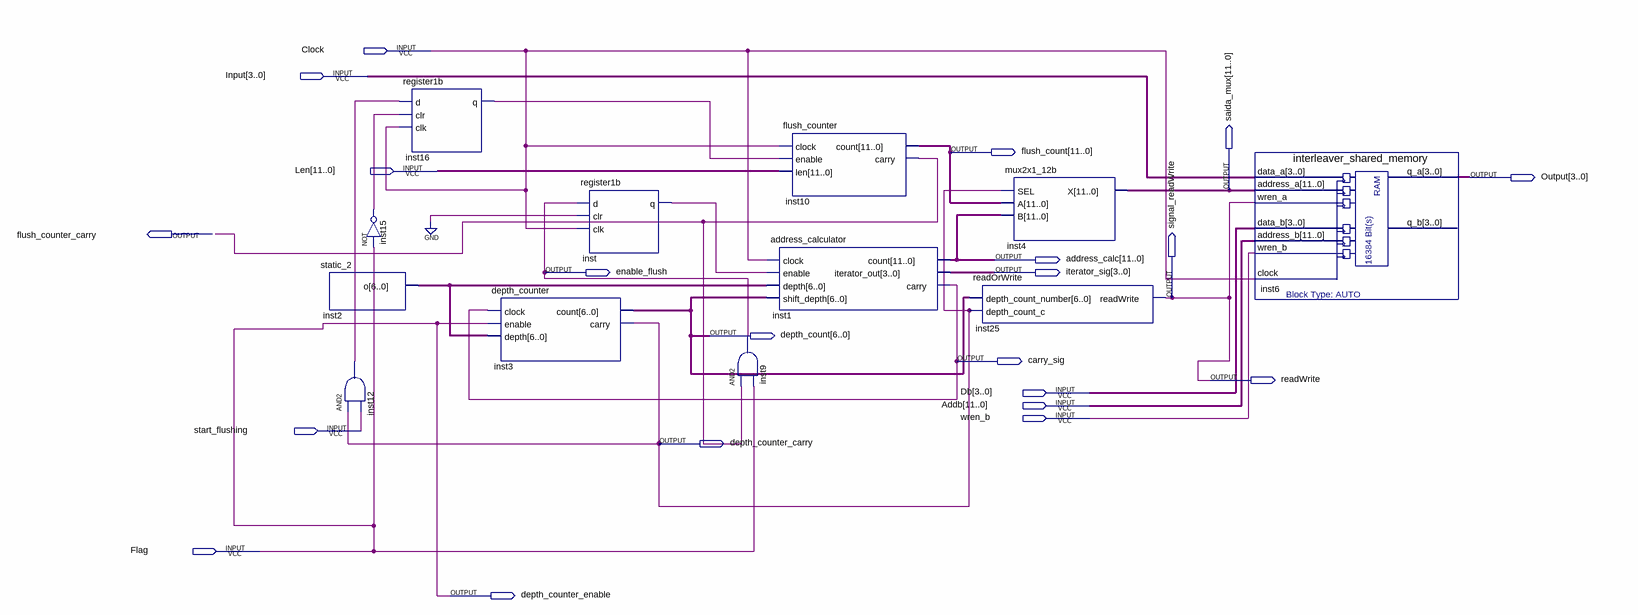
[diagram p0: schematic sheet]
// Quartus schematic interleaver_header.bdf as structural Verilog: 12 symbols, 21 pins
module interleaver_header (
  input  Clock,
  input  [3:0] Input,
  input  [11:0] Len,
  input  [3:0] Db,
  input  [11:0] Addb,
  input  wren_b,
  input  start_flushing,
  input  Flag,
  output [11:0] flush_count,
  output [3:0] Output,
  output [11:0] saida_mux,
  output flush_counter_carry,
  output [11:0] address_calc,
  output enable_flush,
  output [3:0] iterator_sig,
  output signal_readWrite,
  output [6:0] depth_count,
  output carry_sig,
  output readWrite,
  output depth_counter_carry,
  output depth_counter_enable
);

  wire inst12_out, inst15_out, inst16_q, inst_q;
  wire [6:0] inst2_o;

  static_2 inst2 (.o(inst2_o));
  and inst12 (inst12_out, depth_counter_carry, start_flushing);
  register1b inst16 (.d(inst12_out), .clr(inst15_out), .clk(Clock), .q(inst16_q));
  not inst15 (inst15_out, Flag);
  depth_counter inst3 (
    .clock(carry_sig), .enable(Flag), .depth(inst2_o), .count(depth_count), .carry(depth_counter_carry));
  register1b inst (.d(enable_flush), .clr(1'b0), .clk(Clock), .q(inst_q));
  and inst9 (enable_flush, flush_counter_carry, Flag);
  flush_counter inst10 (.clock(Clock), .enable(inst16_q), .len(Len), .count(flush_count), .carry(flush_counter_carry));
  address_calculator inst1 (
    .clock(Clock), .enable(inst_q), .depth(inst2_o), .shift_depth(depth_count), .count(address_calc),
    .iterator_out(iterator_sig), .carry(carry_sig));
  mux2x1_12b inst4 (.SEL(depth_counter_carry), .A(flush_count), .B(address_calc), .X(saida_mux));
  readOrWrite inst25 (.depth_count_number(depth_count), .depth_count_c(depth_counter_carry), .readWrite(readWrite));
  interleaver_shared_memory inst6 (
    .data_a(Input), .address_a(saida_mux), .wren_a(readWrite), .data_b(Db), .address_b(Addb),
    .wren_b(wren_b), .clock(Clock), .q_a(Output));  // open: q_b

  assign depth_counter_enable = Flag;
  assign signal_readWrite = readWrite;
endmodule
